# Altium schematic sheet DisplayDriverAssigment.SchDoc
size A
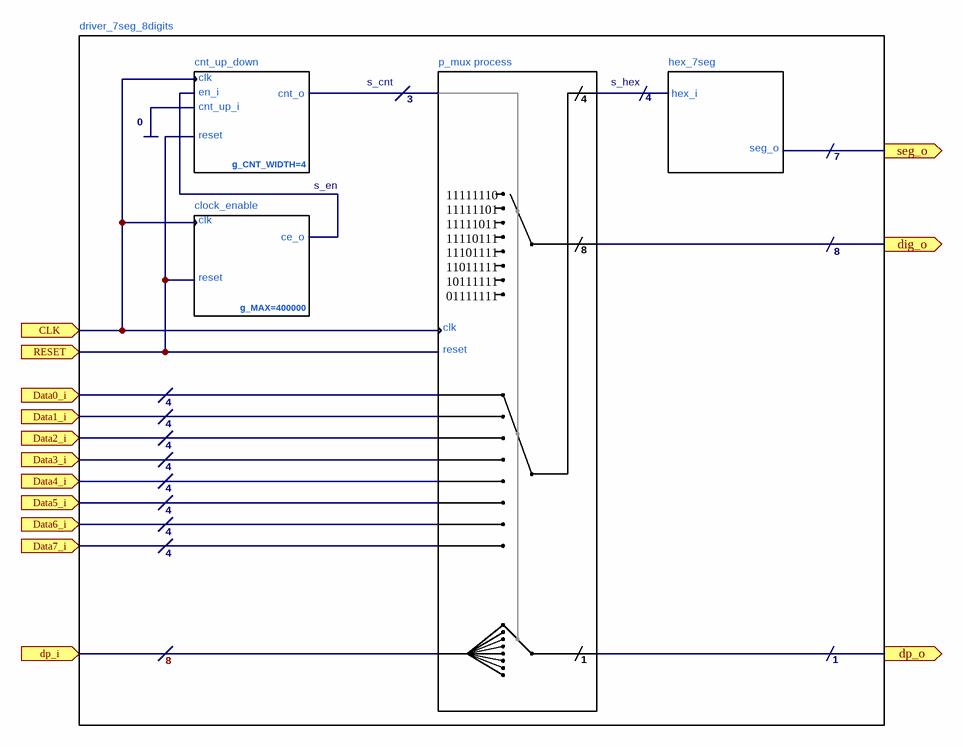
[diagram p0: DisplayDriverAssigment.SchDoc]

## Ports
CLK (in), Data0_i (in), Data1_i (in), Data2_i (in), Data3_i (in), Data4_i (in), Data5_i (in), Data6_i (in), Data7_i (in), dig_o (out), dp_i (in), dp_o (out), RESET (in), seg_o (out)

## Notes on the sheet
- driver_7seg_8digits
- cnt_up_down
- clk
- en_i
- s_cnt
- p_mux process
- s_hex
- hex_7seg
- 0
- cnt_up_i
- reset
- cnt_o
- g_CNT_WIDTH=4
- 3
- 4
- hex_i
- seg_o
- 7
- clock_enable
- s_en
- ce_o
- g_MAX=400000
- 11111110
  11111101
  11111011
  11110111
  11101111
  11011111
  10111111
  01111111
- 8
- 1